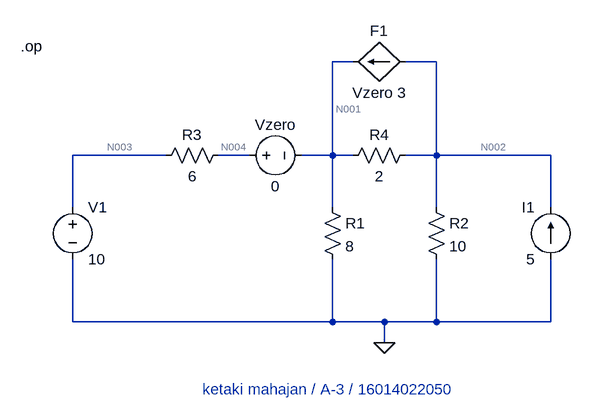
[diagram p0: schematic exp1_2_16014022050.asc]
exp1_2_16014022050.asc, the LTspice schematic file:
Version 4
SHEET 1 880 680
WIRE 336 -48 304 -48
WIRE 464 -48 416 -48
WIRE 48 96 -96 96
WIRE 176 96 128 96
WIRE 304 96 304 -48
WIRE 304 96 256 96
WIRE 336 96 304 96
WIRE 464 96 464 -48
WIRE 464 96 416 96
WIRE 640 96 464 96
WIRE -96 176 -96 96
WIRE 304 176 304 96
WIRE 464 176 464 96
WIRE 640 176 640 96
WIRE -96 352 -96 256
WIRE 304 352 304 256
WIRE 304 352 -96 352
WIRE 384 352 304 352
WIRE 464 352 464 256
WIRE 464 352 384 352
WIRE 640 352 640 256
WIRE 640 352 464 352
WIRE 384 384 384 352
FLAG 384 384 0
SYMBOL res 144 80 R90
WINDOW 0 0 56 VBottom 2
WINDOW 3 32 56 VTop 2
SYMATTR InstName R3
SYMATTR Value 6
SYMBOL voltage -96 160 R0
WINDOW 123 0 0 Left 0
WINDOW 39 0 0 Left 0
SYMATTR InstName V1
SYMATTR Value 10
SYMBOL res 432 80 R90
WINDOW 0 0 56 VBottom 2
WINDOW 3 32 56 VTop 2
SYMATTR InstName R4
SYMATTR Value 2
SYMBOL current 640 256 R180
WINDOW 0 24 80 Left 2
WINDOW 3 24 0 Left 2
SYMATTR InstName I1
SYMATTR Value 5
SYMBOL res 288 160 R0
SYMATTR InstName R1
SYMATTR Value 8
SYMBOL res 448 160 R0
SYMATTR InstName R2
SYMATTR Value 10
SYMBOL f 416 -48 R90
WINDOW 0 -32 40 VBottom 2
WINDOW 3 32 40 VTop 2
SYMATTR InstName F1
SYMATTR Value Vzero 3
SYMBOL voltage 160 96 R270
WINDOW 0 32 56 VTop 2
WINDOW 3 -32 56 VBottom 2
WINDOW 123 0 0 Left 0
WINDOW 39 0 0 Left 0
SYMATTR InstName Vzero
SYMATTR Value 0
TEXT -176 -72 Left 2 !.op
TEXT 104 456 Left 2 ;ketaki mahajan / A-3 / 16014022050

The netlist it stands for:
* exp1_2_16014022050.asc
R3 N004 N003 6
V1 N003 0 10
R4 N002 N001 2
I1 0 N002 5
R1 N001 0 8
R2 N002 0 10
F1 N002 N001 Vzero 3
Vzero N004 N001 0
.op
* ketaki mahajan / A-3 / 16014022050
.backanno
.end

* Results of the author's LTspice run, read from the files saved beside the schematic
* Operating Point:
*   V(n004) = 14.55 V
*   V(n003) = 10 V
*   V(n002) = 24.24 V
*   V(n001) = 14.55 V
*   I(F1) = -2.273 A
*   I(I1) = 5 A
*   I(R3) = 757.6 mA
*   I(R4) = 4.848 A
*   I(R1) = 1.818 A
*   I(R2) = 2.424 A
*   I(V1) = 757.6 mA
*   I(Vzero) = -757.6 mA